# Altium schematic sheet ethernet.SchDoc: DiPho digital
size 420 x 297 mm; Author: P. Daniel; CompanyName: WUT ISE; DrawnBy: P. Daniel; Organization: WUT ISE; Address1: WUT ISE; Address2: Nowowiejska 15/19 00-665 Warsaw; Address3: piotrmaciejdaniel@gmail.com; Revision: 1; SheetNumber: 3; SheetTotal: 4; ModifiedBy: -; CreateDate: 10-12.2021; CheckedDate: -; Title2: PHY schematic; DivGrp: WUT ISE; Designer: Piotr Daniel; ModifiedDate: -; ProjectName: Sensor Box
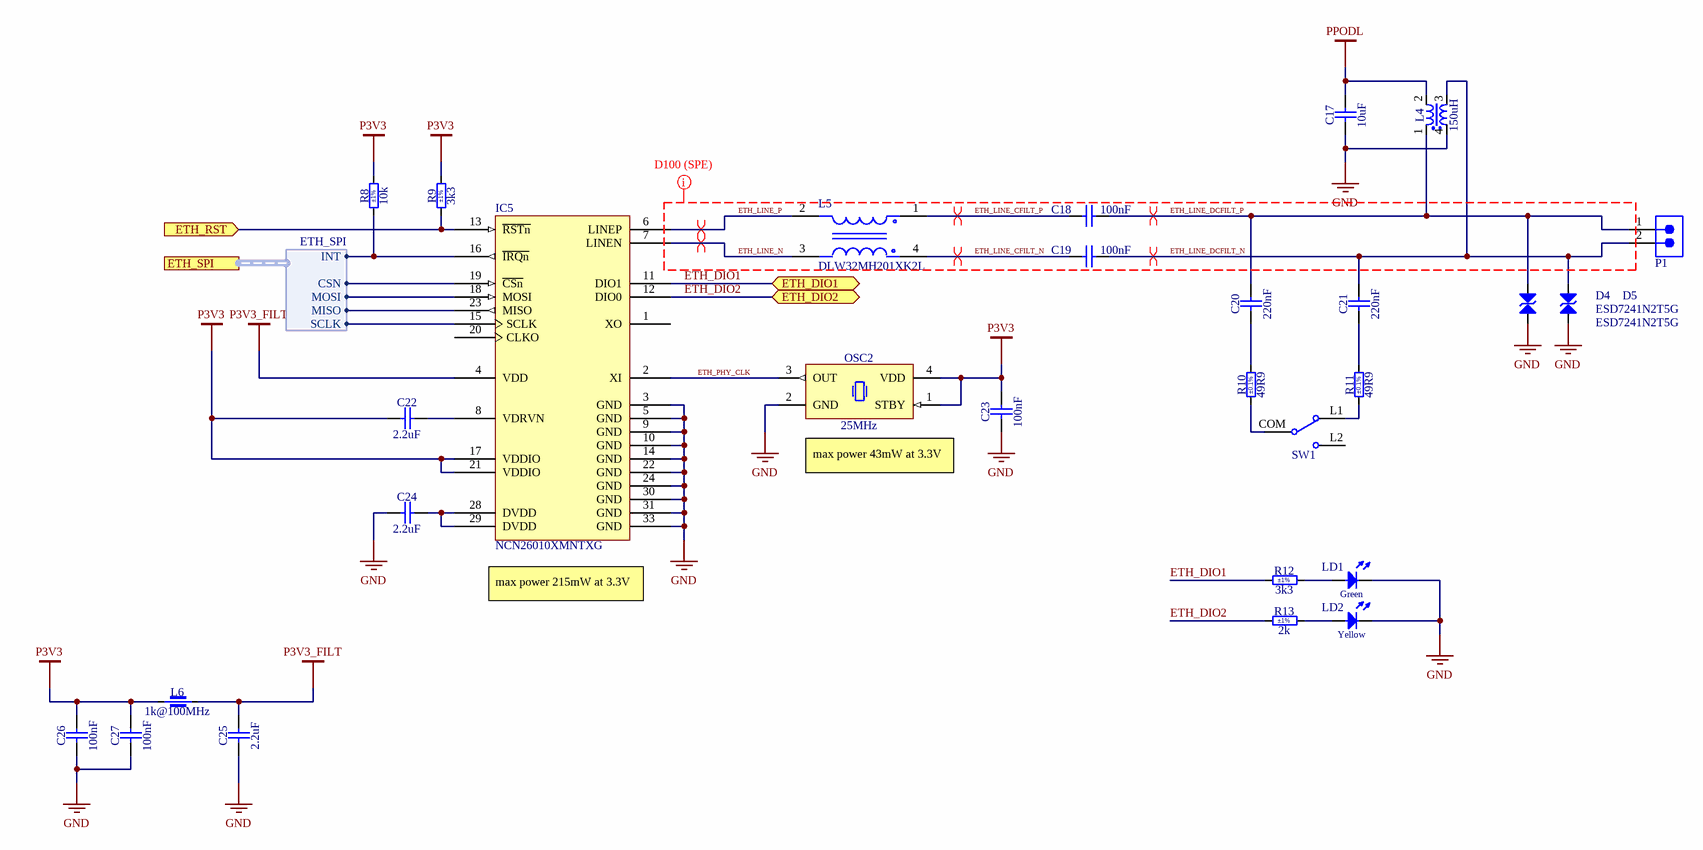
[diagram p0: ethernet.SchDoc]

## Parts
C17  10uF  [CAPC2012X145N]
C18  100nF  [CAPC1005X55N]
C19  100nF  [CAPC1005X55N]
C20  220nF  [CAPC2012X135N]
C21  220nF  [CAPC2012X135N]
C22  2.2uF  [CAPC1005X55N]
C23  100nF  [CAPC1005X55N]
C24  2.2uF  [CAPC1005X55N]
C25  2.2uF  [CAPC1005X55N]
C26  100nF  [CAPC1005X55N]
C27  100nF  [CAPC1005X55N]
D4  ESD7241N2T5G  [DFN65P100X40-2N]
D5  ESD7241N2T5G  [DFN65P100X40-2N]
IC5  NCN26010XMNTXG  [QFN40P400X400X100_HS-33N]
L4  150uH  [IND_COILCRAFT_LPD5030]
L5  DLW32MH201XK2L  [FP-DLW32MH201XK2L-MFG]
L6  1k@100MHz  [INDC1608X100N]
LD1  Green  [LED_LITEON_LTST-C193KGKT-5A]
LD2  Yellow  [LED_LITEON_LTST-C193KSKT-5A]
OSC2  25MHz  [OSC_ABRACON_ASE]
P1  691347000002B  [691347000002B]  (value not drawn)
R8  10k  Tolerance: ±1%  [RESC1005X40N]
R9  3k3  Tolerance: ±1%  [RESC1608X55N]
R10  49R9  Tolerance: ±0.1%  [RESC1608X55N]
R11  49R9  Tolerance: ±0.1%  [RESC1608X55N]
R12  3k3  Tolerance: ±1%  [RESC1005X40N]
R13  2k  Tolerance: ±1%  [RESC1005X40N]
SW1  450301014042  [450301014042]  (value not drawn)

## Ports
ETH_DIO1 (bidir), ETH_DIO2 (bidir), ETH_RST (in), ETH_SPI (harness ETH_SPI)

## Harnesses
ETH_SPI: CSN, SCLK, MOSI, INT, MISO

## Nets
GND: C17.1 C23.1 C24.1 C25.1 C26.1 C27.1 D4.1 D5.1 IC5.3(GND) IC5.5(GND) IC5.9(GND) IC5.10(GND) IC5.14(GND) IC5.22(GND) IC5.24(GND) IC5.30(GND) IC5.31(GND) IC5.33(GND) L4.4 LD1.1(C) LD2.1(C) OSC2.2(GND)
P3V3: C22.1 C23.2 C26.2 C27.2 IC5.17(VDDIO) IC5.21(VDDIO) L6.1 OSC2.1(STBY) OSC2.4(VDD) R8.2 R9.2
P3V3_FILT: C25.2 IC5.4(VDD) L6.2
PPODL: C17.2 L4.2
ETH_DIO1: IC5.11(DIO1) R12.1 ; port ETH_DIO1
ETH_DIO2: IC5.12(DIO0) R13.1 ; port ETH_DIO2
ETH_LINE_CFILT_N: C19.1 L5.4
ETH_LINE_CFILT_P: C18.1 L5.1
ETH_LINE_DCFILT_N: C19.2 C21.2 D4.2 L4.3 P1.2
ETH_LINE_DCFILT_P: C18.2 C20.2 D5.2 L4.1 P1.1
ETH_LINE_N: IC5.7(LINEN) L5.3
ETH_LINE_P: IC5.6(LINEP) L5.2
ETH_PHY_CLK: IC5.2(XI) OSC2.3(OUT)
ETH_RST: IC5.13(~{RSTn}) R9.1 ; port ETH_RST
NetC20_1: C20.1 R10.2
NetC21_1: C21.1 R11.2
NetC22_2: C22.2 IC5.8(VDRVN)
NetC24_2: C24.2 IC5.28(DVDD) IC5.29(DVDD)
NetIC5_15: IC5.15(SCLK) ; port ETH_SPI.SCLK
NetIC5_16: IC5.16(~{IRQn}) R8.1 ; port ETH_SPI.INT
NetIC5_18: IC5.18(MOSI) ; port ETH_SPI.MOSI
NetIC5_19: IC5.19(~{CSn}) ; port ETH_SPI.CSN
NetIC5_23: IC5.23(MISO) ; port ETH_SPI.MISO
NetLD1_2: LD1.2(A) R12.2
NetLD2_2: LD2.2(A) R13.2
NetR10_1: R10.1 SW1.COM
NetR11_1: R11.1 SW1.L1

Not connected (* = marked no-connect by the designer): IC5 1(XO) 20(CLKO); SW1 L2

## Layout directives
differential pair: ETH_LINE_CFILT_N, ETH_LINE_CFILT_P, ETH_LINE_DCFILT_N, ETH_LINE_DCFILT_P, ETH_LINE_N, ETH_LINE_P
rule Differential Pairs Routing [Pref Gap = 5mil    Min Gap  = 5mil    Max Gap  = 5milPref Width = 9.076mil    Min Width  = 3.515mil    Max Width  = 9.076mil]: ETH_LINE_CFILT_N, ETH_LINE_CFILT_P, ETH_LINE_DCFILT_N, ETH_LINE_DCFILT_P, ETH_LINE_N, ETH_LINE_P

## Notes on the sheet
- max power 43mW at 3.3V
- (near IC5) max power 215mW at 3.3V
- Project/Equipment
- Document
- Designer
- Drawn by
- Check.by
- Copyright WUT ISE 2021.
  This documentation describes Open Hardware and is licensed under the CERN OHL v.1.1. You may redistribute and modify this documentation under the terms of the CERN OHL v.1.1. (http://ohwr.org/CERNOHL). This documentation is distributed WITHOUT ANY EXPRESS OR IMPLIED WARRANTY, INCLUDING OF MERCHANTABILITY, SATISFACTORY QUALITY AND FITNESS FOR A PARTICULAR PURPOSE. Please see the CERN OHL v.1.1 for applicable conditions.
- Contact
- File
- Last Mod.
- Print Date
- Sheet
- Size
- A3
- of
- Rev

## Library data of the parts
C17 = CC0805_10UF_35V_10%_X5R_MURATA_GRM21BR6YA106KE43L: Non-polarised capacitor; Part Description: Chip Multilayer Ceramic Capacitor for General Purpose; Manufacturer: MURATA; Voltage: 35V; TC: X5R; Tolerance: ±10%; Part Number: CC0805_10UF_35V_10%_X5R_MURATA_GRM21BR6YA106KE43L; Component Kind: Standard; Component Type: Standard; Pin Count: 2; Value: 10uF; Status: Not Recommended; Manufacturer Part Number: GRM21BR6YA106KE43; Case: 0805; Mounted: Yes; Socket: No; SMD: Yes; Sense: No; ComponentHeight: 1.45mm; HelpURL: \\cern.ch\dfs\Applications\Altium\Datasheets\CC0805_MURATA_GRM21BR6YA106KE43L.pdf; Author: CERN DEM BC; CreateDate: 24.03.2020; LatestRevisionDate: 24.03.2020
C18 C19 = CC0402_100NF_50V_10%_X7R: Non-polarised capacitor; Part Number: CC0402_100NF_50V_10%_X7R; Value: 100nF
C20 C21 = CC0805_220NF_100V_10%_X7R: Non-polarised capacitor; Part Description: SMD Multilayer Chip Ceramic Capacitor; Manufacturer: GENERIC; Manufacturer1 Part Number: GRM21AR72A224KAC5L; Voltage: 100V; TC: X7R; Tolerance: ±10%; Part Number: CC0805_220NF_100V_10%_X7R; Component Kind: Standard; Component Type: Standard; Pin Count: 2; Value: 220nF; Status: Preferred; Manufacturer Part Number: CC0805_220NF_100V_10%_X7R; Case: 0805; Mounted: Yes; Socket: No; SMD: Yes; Sense: No; Manufacturer1 Example: MURATA; Manufacturer1 ComponentHeight: 1mm; HelpURL: \\cern.ch\dfs\Applications\Altium\Datasheets\CC0805_MURATA_GRM21AR72A224KAC5L.pdf; Author: CERN DEM JLC; CreateDate: 08.06.2017; LatestRevisionDate: 08.06.2017
C22 C24 C25 = CC0402_2.2UF_6.3V_10%_X5R: Non-polarised capacitor; Part Number: CC0402_2.2UF_6.3V_10%_X5R; Value: 2.2uF
C23 C26 C27 = CC0402_100NF_16V_10%_X7R: Non-polarised capacitor; Part Description: SMD Multilayer Chip Ceramic Capacitor; Manufacturer: GENERIC; Manufacturer1 Part Number: GRM155R71C104KA88D; Voltage: 16V; TC: X7R; Tolerance: ±10%; Part Number: CC0402_100NF_16V_10%_X7R; Component Kind: Standard; Component Type: Standard; Pin Count: 2; Value: 100nF; Status: Not Recommended; Manufacturer Part Number: CC0402_100NF_16V_10%_X7R; Case: 0402; Mounted: Yes; Socket: No; SMD: Yes; Sense: No; Manufacturer1 Example: MURATA; Manufacturer1 ComponentHeight: 0.55mm; HelpURL: \\cern.ch\dfs\Applications\Altium\Datasheets\CC0402_X7R_MURATA_GRM.pdf; Author: CERN DEM JLC; CreateDate: 05.12.2013; LatestRevisionDate: 03.12.2007
D4 D5 = ESD7241N2T5G: Ultra-Low Capacitance ESD Protection Ultra-Low Capacitance ESD Protection; Manufacturer: ON Semiconductor; Number of Bidirectional Channels: 1; Reverse Standoff Voltage: 24V; Min Breakdown Voltage: 24.3V; Clamping Voltage: 48V; Power Line Protection: No; Supplier 1: Mouser; Manufacturer Part Number: ESD7241N2T5G; RoHS: Yes; Category: ESD and Circuit Protection ICs; Stock 1: 26036; Pricing 1: 1=0,37000, 10=0,30200, 50=0,30200, 100=0,20600, 1000=0,11600, 10000=0,09300 (USD); Mount: Surface Mount; Number of Pins: 2; Min Operating Temperature: -55°C; Max Operating Temperature: 150°C; Resistor Type: Zener; Packaging: Cut Tape; ComponentLink1URL: http://www.farnell.com/datasheets/2907080.pdf?src-supplier=Farnell; ComponentLink1Description: http://www.farnell.com/datasheets/2907080.pdf?src-supplier=Farnell; ComponentLink2URL: http://www.onsemi.com/pub/Collateral/ESD7241-D.PDF?src-supplier=Digi-Key; ComponentLink2Description: http://www.onsemi.com/pub/Collateral/ESD7241-D.PDF?src-supplier=Digi-Key; Supplier Part Number 1: 863-ESD7241N2T5G
IC5 = NCN26010XMNTXG: Ethernet Controller, 10 Mb/s, Single-Pair, MAC + PHY, 802.3cg, 10BASE−T1S Compliant; Manufacturer: ON Semiconductor; Supplier 1: Arrow Electronics; Manufacturer Part Number: NCN26010XMNTXG; RoHS: No; Stock 1: 369; Pricing 1: 1=7,29220, 10=6,57460, 25=6,24800, 100=5,59360, 250=5,34180 (USD); Supplier Part Number 1: NCN26010XMNTXG
L4 = IND_3.3UH_20%_COILCRAFT_LPD5030: Inductor Common Mode; Part Number: LPD5030-154MRC; Part Description: Coupled Inductors for SEPIC Applications, LPD5030 Series; Power: 0.28A; Resistance: 2R43; Tolerance: ±20%; Component Kind: Standard; Component Type: Standard; Pin Count: 2; Value: 150uH; Manufacturer: COILCRAFT; Manufacturer Part Number: LPD5030-154MRC; Mounted: Yes; Socket: No; SMD: Yes; Sense: No; ComponentHeight: 1.2mm; HelpURL: \\cern.ch\dfs\Applications\Altium\Datasheets\IND_COILCRAFT_LPD5030.pdf; Author: CERN DEM JLC; CreateDate: 25.09.2018; LatestRevisionDate: 25.09.2018
L5 = CMP-06045-000003-1: 200UH-20%/+50% (AT 0.1MHZ)70MA R; Manufacturer: Murata; Inductance: 200uH; Automotive Grade: Grade 1; Tolerance: -20/+50%; Value: 200uH; Series Resistance: 4.8Ω; Automotive: Yes; Manufacturer Part Number: DLW32MH201XK2L; Temperature Range Low: -40°C; ComponentLink2URL: https://www.murata.com/products/productdata/8801029685278/QFLC9124.pdf?1544104811000; Lead Free: Yes; Device Class L3: Common Mode Chokes; Device Class L2: EMI / RFI Components; Rms Current: 70mA; Octopart: https://octopart.com/dlw32mh201xk2l-murata-91401020; Digikey Description: 200UH-20%/+50% (AT 0.1MHZ)70MA R; Temperature: -40°C to +125°C; Test Frequency: 0.1MHz; Category: Ind; Package: 0; Temperature Range High: +125°C; ComponentLink2Description: Datasheet; Device Class L1: Passive Components; RoHS: TRUE; Composition: Wirewound; Height: 2.5mm; Mouser Description: Common Mode Chokes Dual 200uH 100kHz 0.07A 4.8Ohm DCR SMD Automotive T/R
L6 = IND0603_WURTH_74279266: Part Description: SMD EMI Suppression Chip Ferrite Bead (WE-CBF Series); Manufacturer: WURTH ELEKTRONIK; Power: 200mA; Resistance: 0.6R; Tolerance: ±25%; Part Number: IND0603_WURTH_74279266; Component Kind: Standard; Component Type: Standard; Pin Count: 2; Value: 1k@100MHz; Manufacturer Part Number: 74279266; Case: 0603; Mounted: Yes; Socket: No; SMD: Yes; Sense: No; ComponentHeight: 1mm; HelpURL: \\cern.ch\dfs\Applications\Altium\Datasheets\IND0603_WURTH_74279266.pdf; Author: CERN DEM JLC; CreateDate: 08.03.2011; LatestRevisionDate: 25.10.2018
LD1 = LED_LITEON_LTST-C193KGKT-5A: LED Green 1C 2A; Part Description: Extra Thin SMD Chip LED, Ultra Bright AlInGaP Green, Lens Water Clear; Manufacturer: LITE-ON SEMICONDUCTOR; PressFit: No; Bonding: No; Part Number: LED_LITEON_LTST-C193KGKT-5A; Component Kind: Standard; Component Type: Standard; Color: Green; PackageDescription: SMD AlInGaP Green LED, Lens Water Clear, 2-Leads, Body 1.6x0.8mm; Manufacturer Part Number: LTST-C193KGKT-5A; Pin Count: 2; Case: 0603; Mounted: Yes; Socket: No; SMD: Yes; Sense: No; ComponentHeight: 0.35mm; HelpURL: \\cern.ch\dfs\Applications\Altium\Datasheets\LED_LITEON_LTST-C193KGKT-5A.pdf; Author: CERN DEM BC; CreateDate: 11.11.2020; LatestRevisionDate: 11.11.2020
LD2 = LED_LITEON_LTST-C193KSKT-5A: LED Yellow 1C 2A; Part Description: Extra Thin SMD Chip LED, Ultra Bright AlInGaP Yellow, Lens Water Clear; Manufacturer: LITE-ON SEMICONDUCTOR; PressFit: No; Bonding: No; Part Number: LED_LITEON_LTST-C193KSKT-5A; Component Kind: Standard; Component Type: Standard; Color: Yellow; PackageDescription: SMD AlInGaP Yellow LED, Lens Water Clear, 2-Leads, Body 1.6x0.8mm; Manufacturer Part Number: LTST-C193KSKT-5A; Pin Count: 2; Case: 0603; Mounted: Yes; Socket: No; SMD: Yes; Sense: No; ComponentHeight: 0.35mm; HelpURL: \\cern.ch\dfs\Applications\Altium\Datasheets\LED_LITEON_LTST-C193KSKT-5A.pdf; Author: CERN DEM BC; CreateDate: 11.11.2020; LatestRevisionDate: 11.11.2020
OSC2 = OSC_25MHZ_ABRACON_ASE-25.000MHZ-LC: Oscillator 4 pins 1=STBY 2=GND 3=OUT 4=VDD; Part Number: ASE-25.000MHZ-LR-T; Part Description: 3.3V, ±50ppm, 15pF, -40..+85°C, CMOS SMD Crystal Oscillator, ASE Series; PressFit: No; Bonding: No; Component Kind: Standard; Component Type: Standard; PackageDescription: SMD Oscillator, Body 3.20mm L X 2.50mm W X 1.20mm H, ASE Serie; Value: 25MHz; Manufacturer: ABRACON; Manufacturer Part Number: ASE-25.000MHZ-LR-T; Pin Count: 4; Mounted: Yes; Socket: No; SMD: Yes; Sense: No; ComponentHeight: 1.2mm; HelpURL: \\cern.ch\dfs\Applications\Altium\Datasheets\XTAL_ABRACON_ASE.pdf; Author: CERN DEM HF; CreateDate: 11.01.2022; LatestRevisionDate: 11.01.2022
P1 = 691347000002B: WR-TBL Series 3470B PCB Header Vertical cable entry, THT, pitch 2.5mm, 2p; Manufacturer: Wurth Elektronik; Modularity: No; Rated Current: 6A; Working Voltage: 150V; ComponentLink1Description: Website Link; ComponentLink1URL: https://www.we-online.com/redexpert/article/691347000002B?ad; ComponentLink2Description: Datasheet Link; ComponentLink2URL: https://www.we-online.com/redexpert/spec/691347000002B?ad; Manufacturer Part Number: 691347000002B; Category: Terminal Blocks; Match Code: WR-TBL; Mount: Through Hole; Operating Temperature Max: 105°C; Operating Temperature Min: -40°C; Packaging: Carton; Application: Plug Screwless Push In; Number of Pins: 2; Number of Rows: 1; Orientation: Vertical Cable Entry; Pitch: 2.5mm
R8 = R0402_10K_1%_0.0625W_100PPM: Resistor - 1%; Part Description: General Purpose Thick Film Chip Resistor; Manufacturer: GENERIC; Manufacturer1 Part Number: 232270671003L; TC: ±100ppm/°C; PressFit: No; Part Number: R0402_10K_1%_0.0625W_100PPM; Component Kind: Standard; Component Type: Standard; Pin Count: 2; Value: 10k; Status: Not Recommended; Power: 0.0625W; Manufacturer Part Number: R0402_10K_1%_0.0625W_100PPM; Case: 0402; Mounted: Yes; Sense: No; Socket: No; SMD: Yes; Manufacturer1 Example: YAGEO PHYCOMP; Manufacturer1 ComponentHeight: 0.4mm; HelpURL: \\cern.ch\dfs\Applications\Altium\Datasheets\R0402_Phycomp_RC0402.pdf; Author: CERN DEM JLC; CreateDate: 03.12.2007; LatestRevisionDate: 17.10.2012
R9 = R0603_3K3_1%_0.1W_100PPM: Resistor - 1%; Part Description: General Purpose Thick Film Chip Resistor; Manufacturer: GENERIC; Manufacturer1 Part Number: NRC06F3301TRF; Power: 0.1W; TC: ±100ppm/°C; PressFit: No; Part Number: R0603_3K3_1%_0.1W_100PPM; Component Kind: Standard; Component Type: Standard; Pin Count: 2; Value: 3k3; Status: Preferred; Manufacturer Part Number: R0603_3K3_1%_0.1W_100PPM; Case: 0603; Mounted: Yes; Sense: No; Socket: No; SMD: Yes; Manufacturer1 Example: NIC COMPONENT; Manufacturer1 ComponentHeight: 0.55mm; HelpURL: \\cern.ch\dfs\Applications\Altium\Datasheets\R0603_NIC_NRC.pdf; Author: CERN DEM JLC; CreateDate: 03.12.2007; LatestRevisionDate: 13.03.2008
R10 R11 = R0603_49R9_0.1%_0.063W_10PPM: Resistor - 0.1%; Part Description: Thin Film Chip Resistor; Manufacturer: GENERIC; Manufacturer1 Part Number: RN73C1J49R9BTDF; Power: 0.063W; TC: ±10ppm; PressFit: No; Part Number: R0603_49R9_0.1%_0.063W_10PPM; Component Kind: Standard; Component Type: Standard; Pin Count: 2; Value: 49R9; Status: Not Recommended; Manufacturer Part Number: R0603_49R9_0.1%_0.063W_10PPM; Case: 0603; Mounted: Yes; Sense: No; Socket: No; SMD: Yes; Manufacturer1 Example: TYCO HOLSWORTHY; Manufacturer1 ComponentHeight: 0.5mm; HelpURL: \\cern.ch\dfs\Applications\Altium\Datasheets\R0603_Tyco_RN73.pdf; Author: CERN DEM JLC; CreateDate: 03.12.2007; LatestRevisionDate: 13.03.2008
R12 = R0402_3K3_1%_0.0625W_100PPM: Resistor - 1%; Part Description: General Purpose Thick Film Chip Resistor; Manufacturer: GENERIC; Manufacturer1 Part Number: 232270673302L; TC: ±100ppm/°C; PressFit: No; Part Number: R0402_3K3_1%_0.0625W_100PPM; Component Kind: Standard; Component Type: Standard; Pin Count: 2; Value: 3k3; Status: Not Recommended; Power: 0.0625W; Manufacturer Part Number: R0402_3K3_1%_0.0625W_100PPM; Case: 0402; Mounted: Yes; Sense: No; Socket: No; SMD: Yes; Manufacturer1 Example: YAGEO PHYCOMP; Manufacturer1 ComponentHeight: 0.4mm; HelpURL: \\cern.ch\dfs\Applications\Altium\Datasheets\R0402_Phycomp_RC0402.pdf; Author: CERN DEM JLC; CreateDate: 03.12.2007; LatestRevisionDate: 17.10.2012
R13 = R0402_2K_1%_0.0625W_100PPM: Resistor - 1%; Part Description: General Purpose Thick Film Chip Resistor; Manufacturer: GENERIC; Manufacturer1 Part Number: 232270672002L; TC: ±100ppm/°C; PressFit: No; Part Number: R0402_2K_1%_0.0625W_100PPM; Component Kind: Standard; Component Type: Standard; Pin Count: 2; Value: 2k; Status: Not Recommended; Power: 0.0625W; Manufacturer Part Number: R0402_2K_1%_0.0625W_100PPM; Case: 0402; Mounted: Yes; Sense: No; Socket: No; SMD: Yes; Manufacturer1 Example: YAGEO PHYCOMP; Manufacturer1 ComponentHeight: 0.4mm; HelpURL: \\cern.ch\dfs\Applications\Altium\Datasheets\R0402_Phycomp_RC0402.pdf; Author: CERN DEM JLC; CreateDate: 03.12.2007; LatestRevisionDate: 17.10.2012
SW1 = 450301014042: WS-SLTV THT Mini Slide Switch, Opposite Side Connection, SPDT, 12VDC, 500mA, 800g; Manufacturer: Wurth Elektronik; ComponentLink1Description: Website Link; ComponentLink1URL: https://www.we-online.com/redexpert/article/450301014042?ad; ComponentLink2Description: Datasheet Link; ComponentLink2URL: https://www.we-online.com/redexpert/spec/450301014042?ad; Manufacturer Part Number: 450301014042; Category: Slide Switches; Match Code: WS-SLTV; Mount: Through Hole; Operating Temperature Max: 85°C; Operating Temperature Min: -40°C; Packaging: Bulk; Length: 10mm; Width: 2.5mm; Height: 6.4mm; Circuit: SPDT; Contact Material: Copper Alloy; Contact Plating: Gold; Operation Force: 800g; Rated Current: 500mA; Rated Voltage: 12VDC; Terminal Material: Copper Alloy; Terminal Plating: Gold